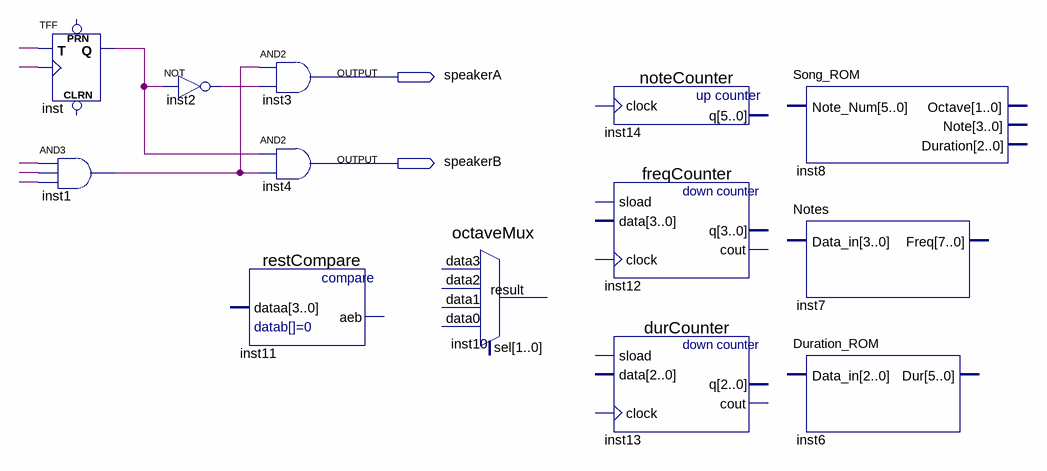
[diagram p0: schematic sheet]
// Quartus schematic MusicLab.bdf as structural Verilog: 13 symbols, 2 pins
module MusicLab (
  output speakerA,
  output speakerB
);

  wire inst1_out, inst2_out, inst_q, undriven, undriven_2, undriven_3, undriven_4, undriven_5;

  TFF inst (.T(undriven_5), .CLK(undriven), .Q(inst_q));  // open: PRN, CLRN
  and inst1 (inst1_out, undriven_2, undriven_3, undriven_4);
  not inst2 (inst2_out, inst_q);
  and inst3 (speakerA, inst1_out, inst2_out);
  and inst4 (speakerB, inst_q, inst1_out);
  restCompare inst11 ();  // open: dataa, aeb
  octaveMux inst10 ();  // open: data3, data2, data1, data0, sel, result
  noteCounter inst14 ();  // open: clock, q
  freqCounter inst12 ();  // open: sload, data, clock, q, cout
  durCounter inst13 ();  // open: sload, data, clock, q, cout
  Song_ROM inst8 ();  // open: Note_Num, Octave, Note, Duration
  Notes inst7 ();  // open: Data_in, Freq
  Duration_ROM inst6 ();  // open: Data_in, Dur
endmodule
